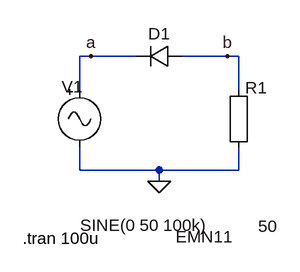
[diagram p0: schematic Diode-Rectifier-demo.asc]
Diode-Rectifier-demo.asc, the LTspice schematic file:
Version 4
SHEET 1 880 680
WIRE -176 144 -192 144
WIRE -112 144 -176 144
WIRE 16 144 -48 144
WIRE 32 144 16 144
WIRE -192 192 -192 144
WIRE 32 192 32 144
WIRE -192 304 -192 272
WIRE -80 304 -192 304
WIRE 32 304 32 272
WIRE 32 304 -80 304
WIRE -80 320 -80 304
FLAG -80 320 0
FLAG -176 144 a
FLAG 16 144 b
SYMBOL diode -48 128 R90
WINDOW 0 0 32 VBottom 2
WINDOW 3 254 -31 VTop 2
SYMATTR InstName D1
SYMATTR Value EMN11
SYMBOL Misc\\EuropeanResistor 16 176 R0
WINDOW 0 25 12 Left 2
WINDOW 3 43 207 Left 2
SYMATTR InstName R1
SYMATTR Value 50
SYMBOL Misc\\signal -192 176 R0
WINDOW 123 0 0 Left 2
WINDOW 39 0 0 Left 2
WINDOW 0 -25 11 Left 2
WINDOW 3 1 206 Left 2
SYMATTR InstName V1
SYMATTR Value SINE(0 50 100k)
TEXT -272 400 Left 2 !.tran 100u

The netlist it stands for:
* Diode-Rectifier-demo.asc
D1 b a EMN11
R1 b 0 50
V1 a 0 SINE(0 50 100k)
.model D D
.lib standard.dio
.tran 100u
.backanno
.end